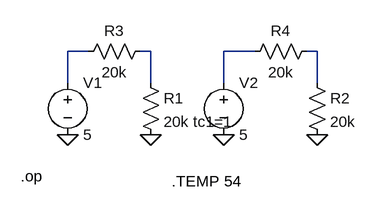
[diagram p0: schematic TEMPERATURA.asc]
TEMPERATURA.asc, the LTspice schematic file:
Version 4
SHEET 1 880 680
WIRE 128 64 96 64
WIRE 224 64 208 64
WIRE 384 64 336 64
WIRE 480 64 464 64
WIRE 96 112 96 64
WIRE 224 112 224 64
WIRE 336 112 336 64
WIRE 480 112 480 64
FLAG 96 192 0
FLAG 224 192 0
FLAG 336 192 0
FLAG 480 192 0
DATAFLAG 224 64 ""
DATAFLAG 480 64 ""
SYMBOL voltage 96 96 R0
SYMATTR InstName V1
SYMATTR Value 5
SYMBOL voltage 336 96 R0
SYMATTR InstName V2
SYMATTR Value 5
SYMBOL res 208 96 R0
SYMATTR InstName R1
SYMATTR Value 20k tc1=1
SYMBOL res 464 96 R0
SYMATTR InstName R2
SYMATTR Value 20k
SYMBOL res 224 48 R90
WINDOW 0 0 56 VBottom 2
WINDOW 3 32 56 VTop 2
SYMATTR InstName R3
SYMATTR Value 20k
SYMBOL res 480 48 R90
WINDOW 0 0 56 VBottom 2
WINDOW 3 32 56 VTop 2
SYMATTR InstName R4
SYMATTR Value 20k
TEXT 256 264 Left 2 !.TEMP 54
TEXT 24 256 Left 2 !.op

The netlist it stands for:
* TEMPERATURA.asc
V1 N001 0 5
V2 N003 0 5
R1 N002 0 20k tc1=1
R2 N004 0 20k
R3 N002 N001 20k
R4 N004 N003 20k
.TEMP 54
.op
.backanno
.end